# Altium schematic sheet GSM Modem Power Feed.SchDoc: GSM Modem Power Feed
size 292 x 193 mm; SheetNumber: 5; SheetTotal: 15
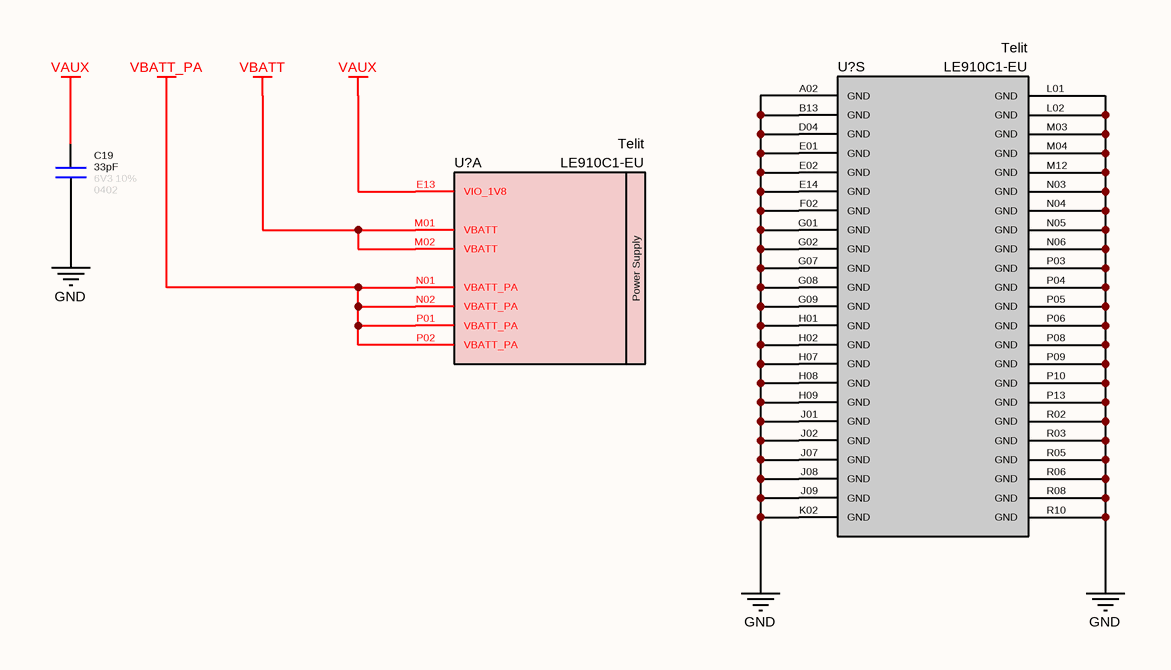
[diagram p0: GSM Modem Power Feed.SchDoc]

## Parts
(Parts that share a designator on the sheet are numbered #1, #2 ... from top to bottom, then left to right.)
C19  value 33pF  Tolerance: 10%  Case: 0402  Voltage: 6V3  [CAPACITOR_0402]  (hidden comment: Capacitor - 33pF [0402] (Ceramic))
U?#1  Manufacturer Part Number: LE910C1-EU  Manufacturer Name: Telit  [LE910 GSM Modem]  (hidden comment: LE910C1-EU LTE GSM Module)  (part S of 20)
U?#2  Manufacturer Part Number: LE910C1-EU  Manufacturer Name: Telit  [LE910 GSM Modem]  (hidden comment: LE910C1-EU LTE GSM Module)  (part A of 20)

## Nets
GND: C19.1 U?#1.A02(GND) U?#1.B13(GND) U?#1.D04(GND) U?#1.E01(GND) U?#1.E02(GND) U?#1.E14(GND) U?#1.F02(GND) U?#1.G01(GND) U?#1.G02(GND) U?#1.G07(GND) U?#1.G08(GND) U?#1.G09(GND) U?#1.H01(GND) U?#1.H02(GND) U?#1.H07(GND) U?#1.H08(GND) U?#1.H09(GND) U?#1.J01(GND) U?#1.J02(GND) U?#1.J07(GND) U?#1.J08(GND) U?#1.J09(GND) U?#1.K02(GND) U?#1.L01(GND) U?#1.L02(GND) U?#1.M03(GND) U?#1.M04(GND) U?#1.M12(GND) U?#1.N03(GND) U?#1.N04(GND) U?#1.N05(GND) U?#1.N06(GND) U?#1.P03(GND) U?#1.P04(GND) U?#1.P05(GND) U?#1.P06(GND) U?#1.P08(GND) U?#1.P09(GND) U?#1.P10(GND) U?#1.P13(GND) U?#1.R02(GND) U?#1.R03(GND) U?#1.R05(GND) U?#1.R06(GND) U?#1.R08(GND) U?#1.R10(GND)
VAUX: C19.2 U?#2.E13(VIO_1V8)
VBATT: U?#2.M01(VBATT) U?#2.M02(VBATT)
VBATT_PA: U?#2.N01(VBATT_PA) U?#2.N02(VBATT_PA) U?#2.P01(VBATT_PA) U?#2.P02(VBATT_PA)

## Notes on the sheet
- © 2021 All rights reserved.
  This document may not, in whole or in part, be copied, photocopied, reproduced, translated or converted to any electronic or machine readable from without prior written permission of Mehmet Günce Akkoyun.
  Engineer contact : akkoyun@me.com
- Property of
- Engineer :
- Date :
- Size :
- A4
- Time :
- Project :
- Page :
- /
- Customer :
- Product ID :
- Module ID :
- Version :
- File :
- Revision :
- (in symbol IC - LE910C1-EU, part A) Power Supply

## Library data of the parts
C19 = Capacitor - 33pF [0402-6V3]: Manufacturer Name: Kemet; Manufacturer Part Number: C0402C330J9RACAUTO; ComponentLink1Description: DataSheet; ComponentLink1URL: https://api.kemet.com/component-edge/download/datasheet/C0402C330J9RACAUTO.pdf; ComponentLink2Description: Mouser; ComponentLink2URL: https://www.mouser.com/Search/Refine.aspx?Keyword=80-C0402C330J9RAUTO
U?#1 U?#2 = IC - LE910C1-EU: Telit LE910C1-EU LTE/2G GSM Module; Case: BGA